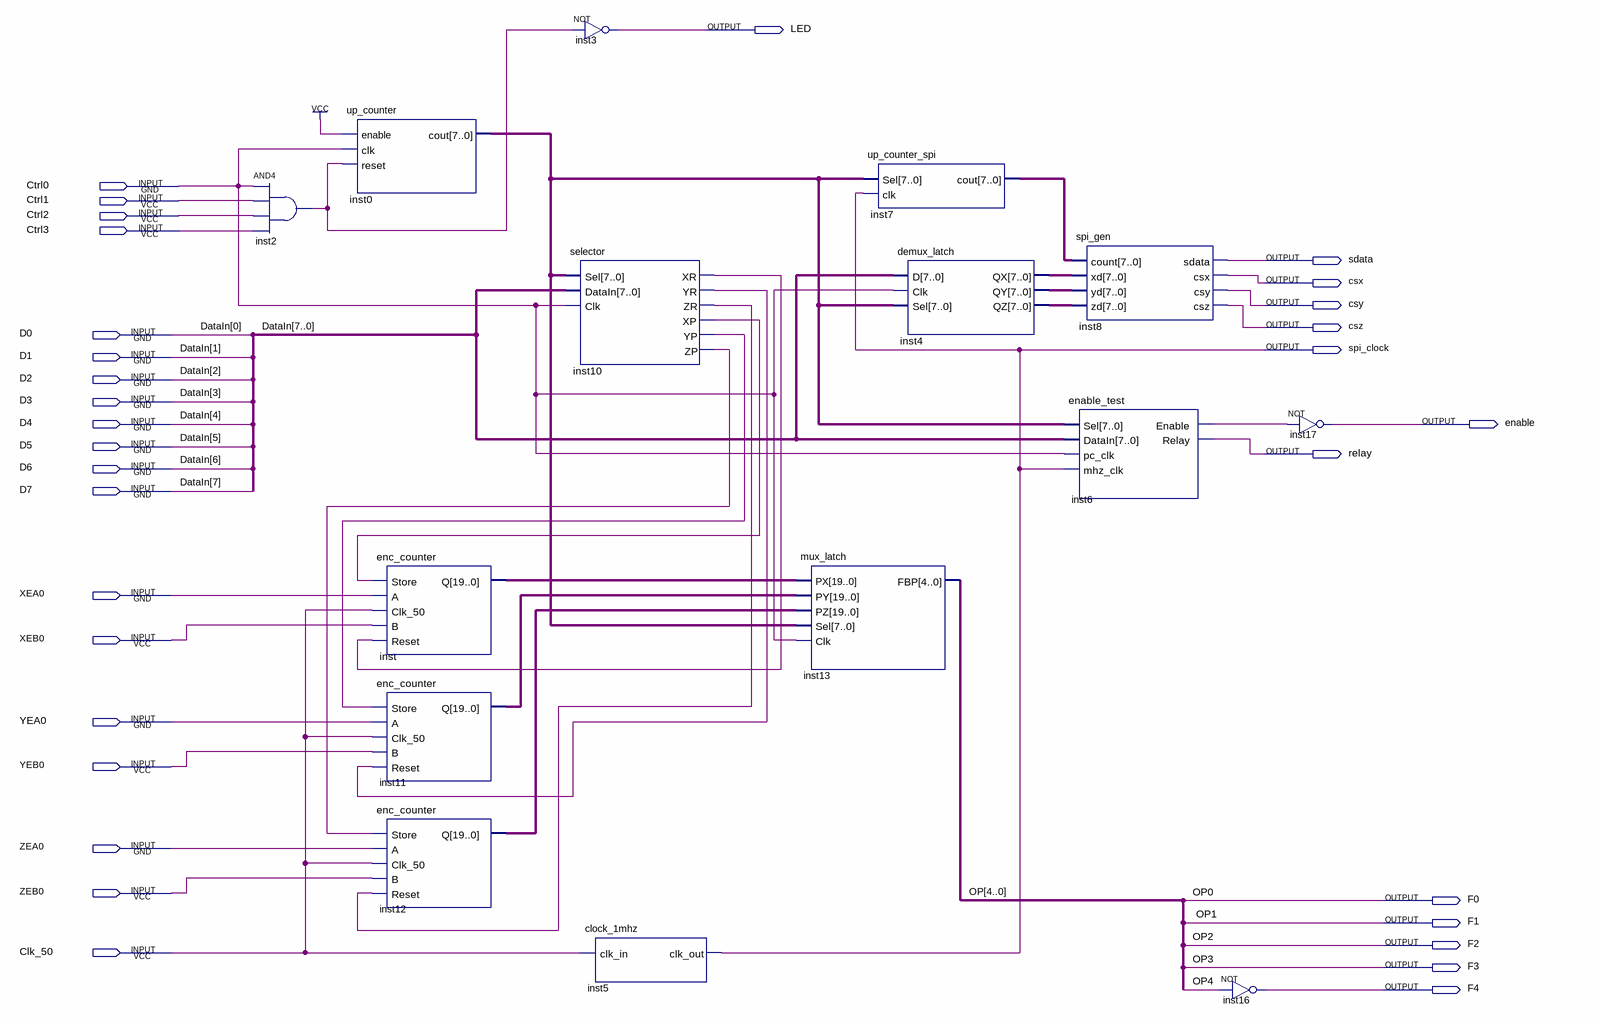
[diagram p0: schematic sheet]
// Quartus schematic Hawk.bdf as structural Verilog: 15 symbols, 32 pins
module Hawk (
  input  Ctrl0,
  input  Ctrl1,
  input  Ctrl2,
  input  Ctrl3,
  input  D0,
  input  D1,
  input  D2,
  input  D3,
  input  D4,
  input  D5,
  input  D6,
  input  D7,
  input  XEA0,
  input  XEB0,
  input  YEA0,
  input  YEB0,
  input  ZEA0,
  input  ZEB0,
  input  Clk_50,
  output LED,
  output sdata,
  output csx,
  output csy,
  output csz,
  output spi_clock,
  output enable,
  output relay,
  output F0,
  output F1,
  output F2,
  output F3,
  output F4
);

  wire inst2_out, inst6_enable, inst10_xp, inst10_xr, inst10_yp, inst10_yr, inst10_zp, inst10_zr;
  wire [4:4] OP;
  wire [7:0] inst0_cout, inst4_qx, inst4_qy, inst4_qz, inst7_cout;
  wire [19:0] inst11_q, inst12_q, inst_q;

  and inst2 (inst2_out, Ctrl0, Ctrl1, Ctrl2, Ctrl3);
  up_counter inst0 (.enable(1'b1), .clk(Ctrl0), .reset(inst2_out), .cout(inst0_cout));
  enc_counter inst (.Store(inst10_xp), .A(XEA0), .Clk_50(Clk_50), .B(XEB0), .Reset(inst10_xr), .Q(inst_q));
  enc_counter inst11 (.Store(inst10_yp), .A(YEA0), .Clk_50(Clk_50), .B(YEB0), .Reset(inst10_yr), .Q(inst11_q));
  enc_counter inst12 (.Store(inst10_zp), .A(ZEA0), .Clk_50(Clk_50), .B(ZEB0), .Reset(inst10_zr), .Q(inst12_q));
  not inst3 (LED, inst2_out);
  selector inst10 (
    .Sel(inst0_cout), .DataIn({D7, D6, D5, D4, D3, D2, D1, D0}), .Clk(Ctrl0), .XR(inst10_xr), .YR(inst10_yr),
    .ZR(inst10_zr), .XP(inst10_xp), .YP(inst10_yp), .ZP(inst10_zp));
  clock_1mhz inst5 (.clk_in(Clk_50), .clk_out(spi_clock));
  mux_latch inst13 (
    .PX(inst_q), .PY(inst11_q), .PZ(inst12_q), .Sel(inst0_cout), .Clk(Ctrl0), .FBP({OP[4], F3, F2, F1, F0}));
  up_counter_spi inst7 (.Sel(inst0_cout), .clk(spi_clock), .cout(inst7_cout));
  demux_latch inst4 (
    .D({D7, D6, D5, D4, D3, D2, D1, D0}), .Clk(Ctrl0), .Sel(inst0_cout), .QX(inst4_qx), .QY(inst4_qy),
    .QZ(inst4_qz));
  spi_gen inst8 (
    .count(inst7_cout), .xd(inst4_qx), .yd(inst4_qy), .zd(inst4_qz), .sdata(sdata), .csx(csx), .csy(csy),
    .csz(csz));
  enable_test inst6 (
    .Sel(inst0_cout), .DataIn({D7, D6, D5, D4, D3, D2, D1, D0}), .pc_clk(Ctrl0), .mhz_clk(spi_clock),
    .Enable(inst6_enable), .Relay(relay));
  not inst16 (F4, OP[4]);
  not inst17 (enable, inst6_enable);

  // Other names for the same wires on the sheet: DataIn[7:0] = {D7, D6, D5, D4, D3, D2, D1, D0};
  //   OP[3:0] = {F3, F2, F1, F0}; OP0 = F0; OP1 = F1; OP2 = F2; OP3 = F3
endmodule
